# EAGLE schematic Arduino_Shield (EAGLE 6.5.0)
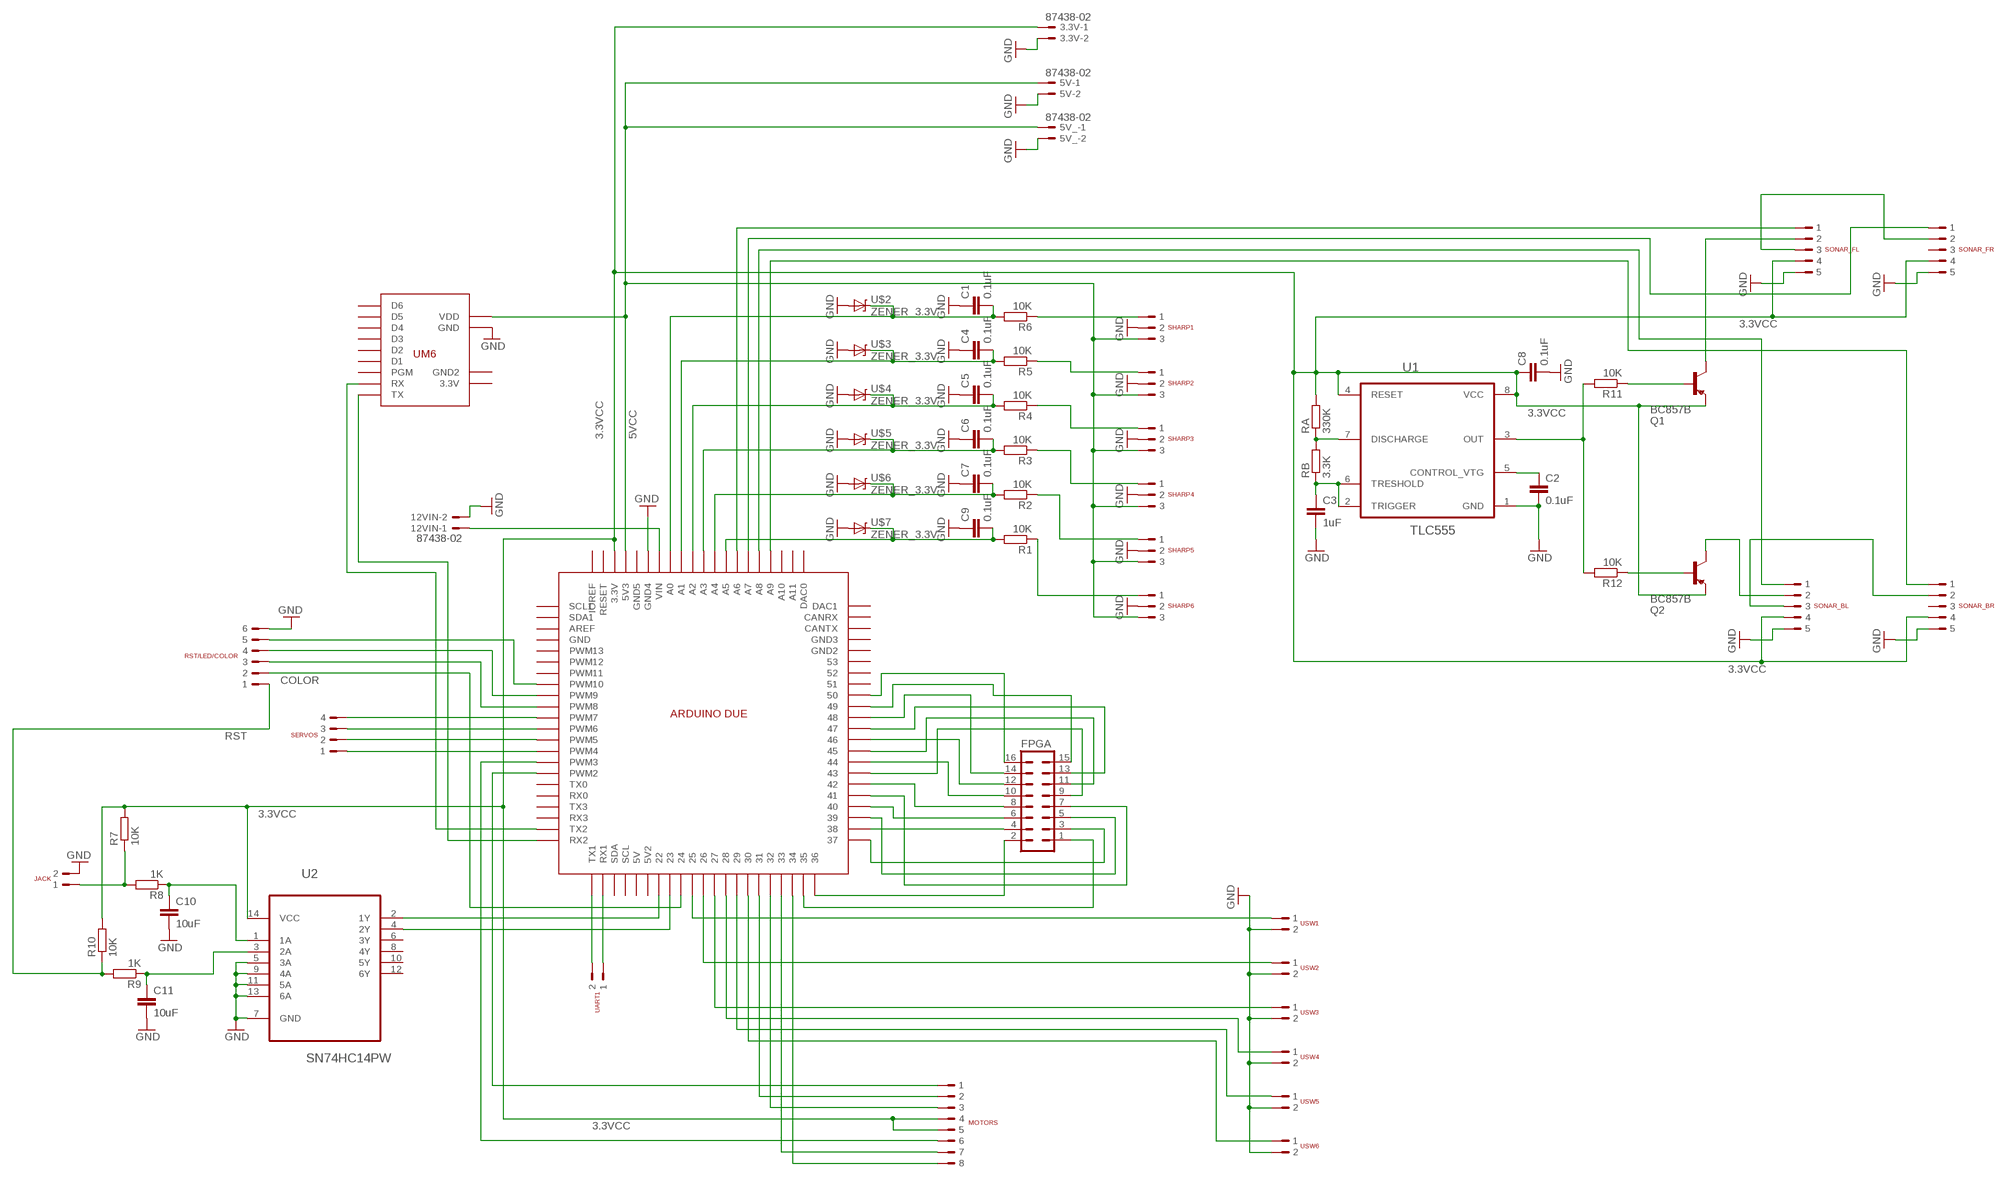
[diagram p0: schematic, sheet 1]

## Parts
3.3V  87438-02  [87438-02]
5V  87438-02  [87438-02]
5V_  87438-02  [87438-02]
12VIN  87438-02  [87438-02]
C1  0.1uF  C-EUC0603  [C0603]
C2  0.1uF  C-EUC0603  [C0603]
C3  1uF  C-EUC0603  [C0603]
C4  0.1uF  C-EUC0603  [C0603]
C5  0.1uF  C-EUC0603  [C0603]
C6  0.1uF  C-EUC0603  [C0603]
C7  0.1uF  C-EUC0603  [C0603]
C8  0.1uF  C-EUC0603  [C0603]
C9  0.1uF  C-EUC0603  [C0603]
C10  10uF  C-EUC0603  [C0603]
C11  10uF  C-EUC0603  [C0603]
FPGA  ML16  [ML16]
JACK  87437-0243  [87437-0243]
MOTORS  87437-0843  [87437-0843]
Q1  BC857B  MMBTA56-SOT23  [SOT23]
Q2  BC857B  MMBTA56-SOT23  [SOT23]
R1  10K  R-EU_R0603  [R0603]
R2  10K  R-EU_R0603  [R0603]
R3  10K  R-EU_R0603  [R0603]
R4  10K  R-EU_R0603  [R0603]
R5  10K  R-EU_R0603  [R0603]
R6  10K  R-EU_R0603  [R0603]
R7  10K  R-EU_R0603  [R0603]
R8  1K  R-EU_R0603  [R0603]
R9  1K  R-EU_R0603  [R0603]
R10  10K  R-EU_R0603  [R0603]
R11  10K  R-EU_R0603  [R0603]
R12  10K  R-EU_R0603  [R0603]
RA  330K  R-EU_R0603  [R0603]
RB  3.3K  R-EU_R0603  [R0603]
RST/LED/COLOR  87437-0643  [87437-0643]
SERVOS  87437-0443  [87437-0443]
SHARP1  87437-0343  [87437-0343]
SHARP2  87437-0343  [87437-0343]
SHARP3  87437-0343  [87437-0343]
SHARP4  87437-0343  [87437-0343]
SHARP5  87437-0343  [87437-0343]
SHARP6  87437-0343  [87437-0343]
SONAR_BL  87437-0543  [87437-0543]
SONAR_BR  87437-0543  [87437-0543]
SONAR_FL  87437-0543  [87437-0543]
SONAR_FR  87437-0543  [87437-0543]
U1  TLC555  LM555CM  [SOIC127P600X175-8N]
U2  SN74HC14PW  [SOP65P640X120-14N]
U$1  ARDUINO-DUE  [ARDUINO-DUE]
U$2  ZENER_3.3V  DIODE-ZENER-BZT52  [SOD-323]
U$3  ZENER_3.3V  DIODE-ZENER-BZT52  [SOD-323]
U$4  ZENER_3.3V  DIODE-ZENER-BZT52  [SOD-323]
U$5  ZENER_3.3V  DIODE-ZENER-BZT52  [SOD-323]
U$6  ZENER_3.3V  DIODE-ZENER-BZT52  [SOD-323]
U$7  ZENER_3.3V  DIODE-ZENER-BZT52  [SOD-323]
UART1  87437-0243  [87437-0243]
UM6  UM6  [UM6]
USW1  87437-0243  [87437-0243]
USW2  87437-0243  [87437-0243]
USW3  87437-0243  [87437-0243]
USW4  87437-0243  [87437-0243]
USW5  87437-0243  [87437-0243]
USW6  87437-0243  [87437-0243]

## Nets
3.3VCC: 3.3V.1 C8.1 MOTORS.P$4 MOTORS.P$5 Q1.2(E) Q2.2(E) R7.2 R10.2 RA.2 SONAR_BL.P$4 SONAR_BR.P$4 SONAR_FL.P$4 SONAR_FR.P$4 U1.4(RESET) U1.8(VCC) U2.14(VCC) U$1.3.3V
5VCC: 5V.1 5V_.1 SHARP1.P$3 SHARP2.P$3 SHARP3.P$3 SHARP4.P$3 SHARP5.P$3 SHARP6.P$3 U$1.5V3 UM6.P$10(VDD)
12VIN: 12VIN.1 U$1.VIN
COLOR: RST/LED/COLOR.P$2 U$1.24
GND: 3.3V.2 5V.2 5V_.2 12VIN.2 C1.1 C2.2 C3.2 C4.1 C5.1 C6.1 C7.1 C8.2 C9.1 C10.2 C11.2 JACK.P$2 RST/LED/COLOR.P$6 SHARP1.P$2 SHARP2.P$2 SHARP3.P$2 SHARP4.P$2 SHARP5.P$2 SHARP6.P$2 SONAR_BL.P$5 SONAR_BR.P$5 SONAR_FL.P$5 SONAR_FR.P$5 U1.1(GND) U2.5(3A) U2.7(GND) U2.9(4A) U2.11(5A) U2.13(6A) U$1.GND4 U$2.2(A) U$3.2(A) U$4.2(A) U$5.2(A) U$6.2(A) U$7.2(A) UM6.P$11(GND) USW1.P$2 USW2.P$2 USW3.P$2 USW4.P$2 USW5.P$2 USW6.P$2
MOTOR1_BREAK: MOTORS.P$3 U$1.32
MOTOR1_DIR: MOTORS.P$2 U$1.31
MOTOR1_PWM: MOTORS.P$1 U$1.PWM2
MOTOR2_BREAK: MOTORS.P$8 U$1.34
MOTOR2_DIR: MOTORS.P$7 U$1.33
MOTOR2_PWM: MOTORS.P$6 U$1.PWM3
N$2: RST/LED/COLOR.P$3 U$1.PWM8
N$3: SERVOS.P$1 U$1.PWM4
N$4: SERVOS.P$2 U$1.PWM5
N$5: SERVOS.P$3 U$1.PWM6
N$6: SERVOS.P$4 U$1.PWM7
N$9: U$1.TX1 UART1.P$2
N$10: U$1.RX1 UART1.P$1
N$11: U2.2(1Y) U$1.22
N$12: RST/LED/COLOR.P$4 U$1.PWM9
N$13: RST/LED/COLOR.P$5 U$1.PWM10
N$14: U2.4(2Y) U$1.23
N$27: JACK.P$1 R7.1 R8.2
N$33: C3.1 RB.1 U1.2(TRIGGER) U1.6(TRESHOLD)
N$34: C2.1 U1.5(CONTROL_VTG)
N$35: RA.1 RB.2 U1.7(DISCHARGE)
N$36: R11.2 R12.2 U1.3(OUT)
N$37: Q2.1(B) R12.1
N$38: Q1.1(B) R11.1
N$39: SONAR_FL.P$3 SONAR_FR.P$2
N$40: SONAR_BL.P$3 SONAR_BR.P$2
N$44: FPGA.1 U$1.35
N$45: Q1.3(C) SONAR_FL.P$2
N$46: Q2.3(C) SONAR_BL.P$2
N$47: FPGA.2 U$1.36
N$48: FPGA.3 U$1.37
N$49: FPGA.4 U$1.38
N$50: FPGA.5 U$1.39
N$51: FPGA.6 U$1.40
N$52: FPGA.7 U$1.41
N$53: FPGA.8 U$1.42
N$54: FPGA.9 U$1.43
N$55: FPGA.10 U$1.44
N$56: FPGA.11 U$1.45
N$57: FPGA.12 U$1.46
N$58: FPGA.13 U$1.47
N$59: FPGA.14 U$1.48
N$60: FPGA.15 U$1.49
N$61: FPGA.16 U$1.50
N$62: R5.1 SHARP2.P$1
N$63: R4.1 SHARP3.P$1
N$64: R3.1 SHARP4.P$1
N$65: R2.1 SHARP5.P$1
N$66: R1.1 SHARP6.P$1
N$67: C10.1 R8.1 U2.1(1A)
N$69: R6.1 SHARP1.P$1
N$71: C11.1 R9.1 U2.3(2A)
RST: R9.2 R10.1 RST/LED/COLOR.P$1
SHARP1: C1.2 R6.2 U$1.A0 U$2.1(C)
SHARP2: C4.2 R5.2 U$1.A1 U$3.1(C)
SHARP3: C5.2 R4.2 U$1.A2 U$4.1(C)
SHARP4: C6.2 R3.2 U$1.A3 U$5.1(C)
SHARP5: C7.2 R2.2 U$1.A4 U$6.1(C)
SHARP6: C9.2 R1.2 U$1.A5 U$7.1(C)
SONAR_BL: SONAR_BL.P$1 U$1.A8
SONAR_BR: SONAR_BR.P$1 U$1.A9
SONAR_FL: SONAR_FL.P$1 U$1.A6
SONAR_FR: SONAR_FR.P$1 U$1.A7
UM6_RX: U$1.TX2 UM6.P$2(RX)
UM6_TX: U$1.RX2 UM6.P$1(TX)
USW1: U$1.25 USW1.P$1
USW2: U$1.26 USW2.P$1
USW3: U$1.27 USW3.P$1
USW4: U$1.28 USW4.P$1
USW5: U$1.29 USW5.P$1
USW6: U$1.30 USW6.P$1
Unconnected: SONAR_BR.P$3 SONAR_FR.P$3 U2.6(3Y) U2.8(4Y) U2.10(5Y) U2.12(6Y) U$1.5V U$1.5V2 U$1.51 U$1.52 U$1.53 U$1.A10 U$1.A11 U$1.AREF U$1.CANRX U$1.CANTX U$1.DAC0 U$1.DAC1 U$1.GND U$1.GND2 U$1.GND3 U$1.GND5 U$1.IOREF U$1.PWM11 U$1.PWM12 U$1.PWM13 U$1.RESET U$1.RX0 U$1.RX3 U$1.SCL U$1.SCL1 U$1.SDA U$1.SDA1 U$1.TX0 U$1.TX3 UM6.P$3(PGM) UM6.P$4(D1) UM6.P$5(D2) UM6.P$6(D3) UM6.P$7(D4) UM6.P$8(D5) UM6.P$9(D6) UM6.P$12(GND2) UM6.P$13(3.3V)

## Library data of the parts
3.3V 5V 5V_ 12VIN = con-molex:87438-02: Wire-to-Board 1.50mm (.059") Pitch Header - Right Angle, SMT, Shrouded Source: http://www.molex.com/product/micro/87438.html; OC_FARNELL: 1711327; OC_NEWARK: unknown
C1-C11 = rcl:C-EU: CAPACITOR, European symbol
FPGA = con-harting-ml:ML16: HARTING; OC_FARNELL: unknown; OC_NEWARK: unknown
JACK UART1 USW1-USW6 = custom:87437-0243
MOTORS = custom:87437-0843
Q1 Q2 = transistor-pnp:*-?: PNP Transistor
R1-R12 RA RB = rcl:R-EU_: RESISTOR, European symbol
RST/LED/COLOR = custom:87437-0643
SERVOS = custom:87437-0443
SHARP1-SHARP6 = custom:87437-0343
SONAR_BL SONAR_BR SONAR_FL SONAR_FR = custom:87437-0543
U1 = custom:LM555CM: Single Timer; MPN: LM555CM; OC_FARNELL: 9488227; OC_NEWARK: 78K6011; PACKAGE: SOIC-8; SUPPLIER: LM555CM
U2 = custom:SN74HC14PW: HEX SCHMITT-TRIGGER INVERTERS; MPN: SN74HC14PW; OC_FARNELL: 9591133; OC_NEWARK: 02H5414; PACKAGE: TSSOP-14; SUPPLIER: Texas Instruments
U$1 = custom:ARDUINO-DUE
U$2-U$7 = SparkFun:DIODE-ZENER: Zener Diode Production Part - 8199 3.4V Zener Voltage
UM6 = custom:UM6